# EAGLE schematic lidar (EAGLE 9.3.0)
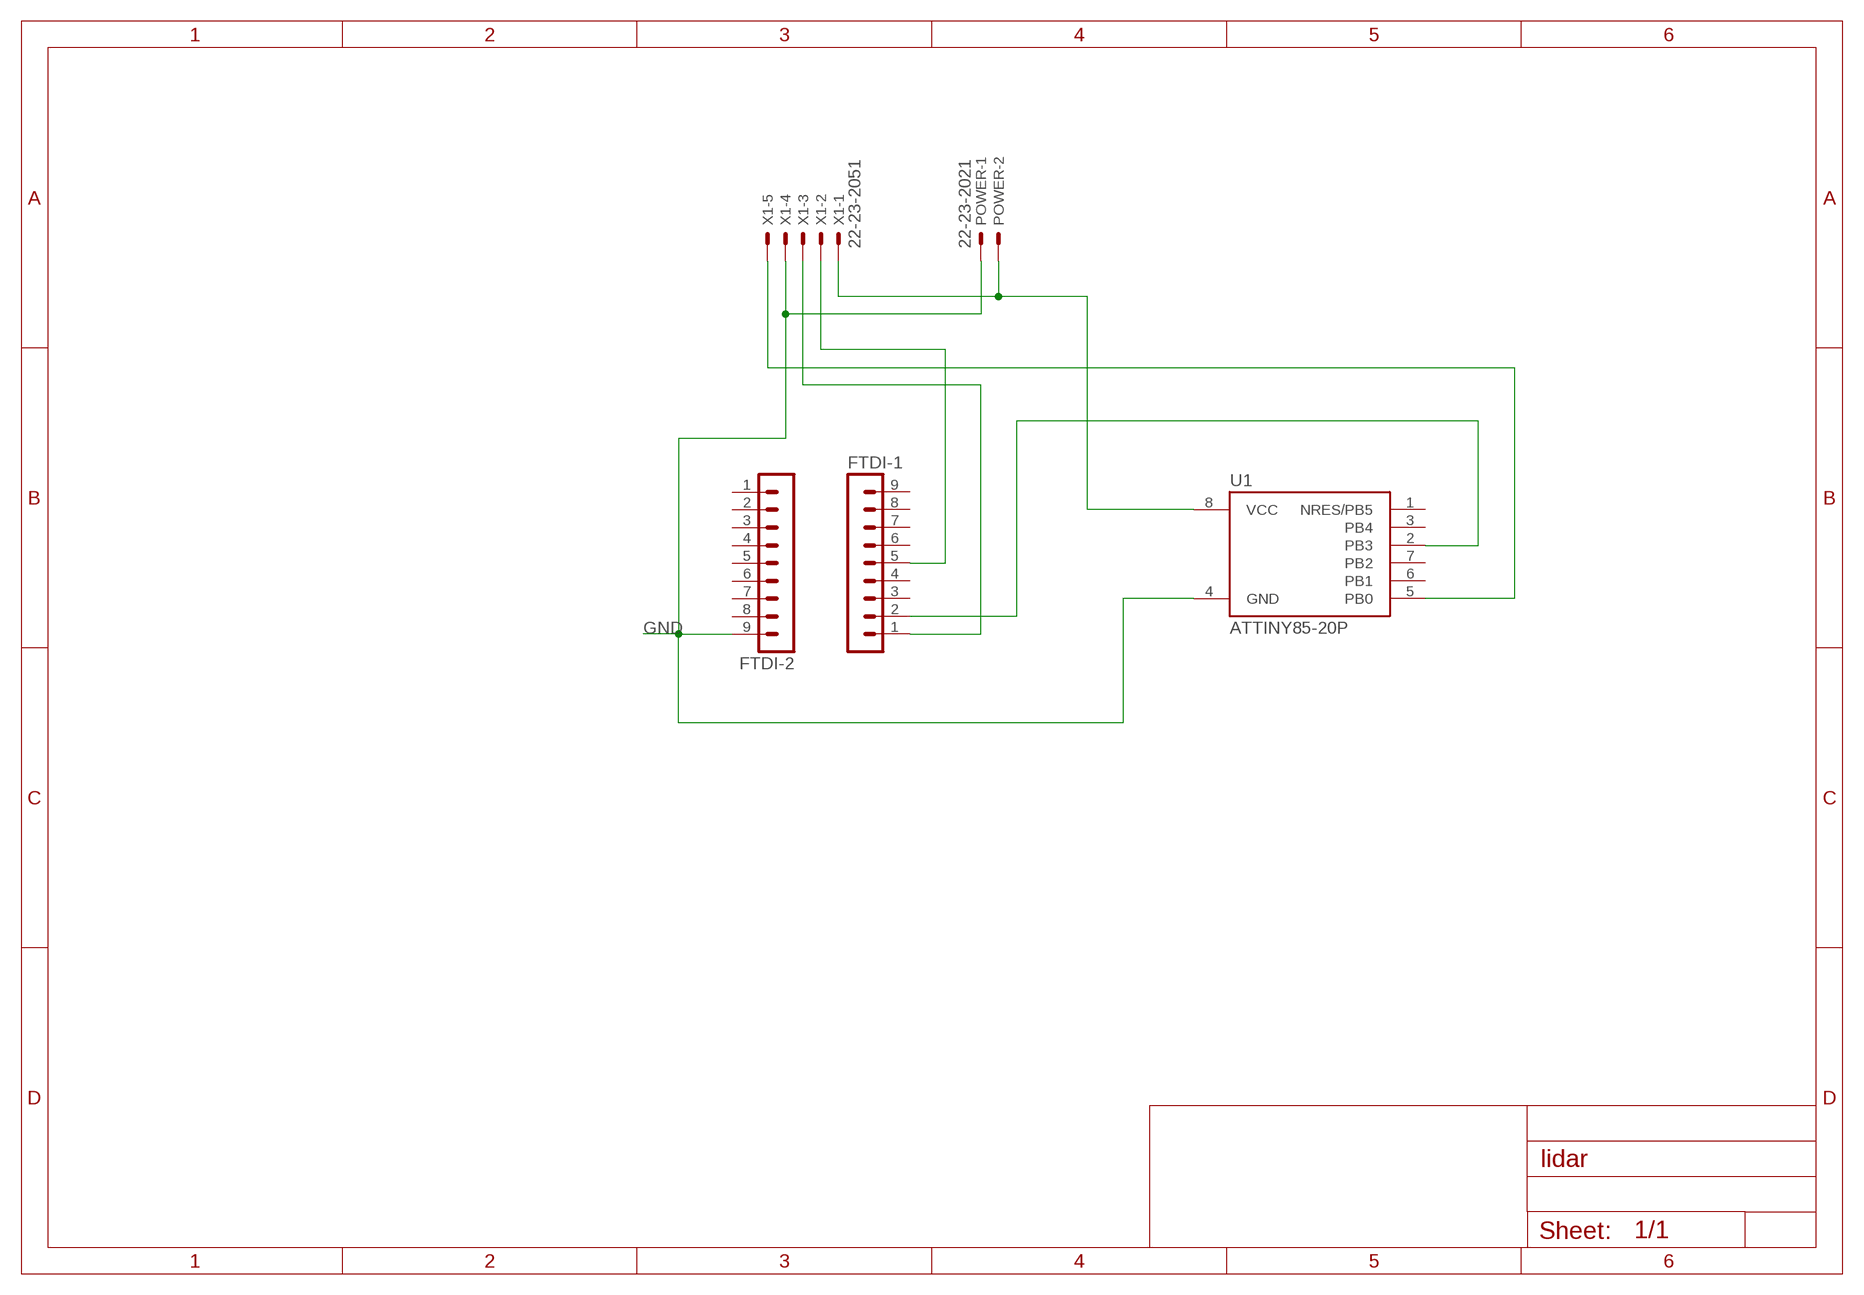
[diagram p0: schematic, sheet 1]

## Parts
FTDI-1  MA09-1  [MA09-1]
FTDI-2  MA09-1  [MA09-1]
POWER  22-23-2021  [22-23-2021]
U1  ATTINY85-20P  [PDIP08_300MIL]
X1  22-23-2051  [22-23-2051]

## Nets
GND: FTDI-2.9 POWER.1 U1.4(GND) X1.4
N$2: FTDI-1.2 U1.2(PB3)
N$3: POWER.2 U1.8(VCC) X1.1
N$4: FTDI-1.5 X1.2
N$5: FTDI-1.1 X1.3
N$7: U1.5(PB0) X1.5
Unconnected: FTDI-1.3 FTDI-1.4 FTDI-1.6 FTDI-1.7 FTDI-1.8 FTDI-1.9 FTDI-2.1 FTDI-2.2 FTDI-2.3 FTDI-2.4 FTDI-2.5 FTDI-2.6 FTDI-2.7 FTDI-2.8 U1.1(NRES/PB5) U1.3(PB4) U1.6(PB1) U1.7(PB2)

## Library data of the parts
FTDI-1 FTDI-2 = con-lstb:MA09-1: PIN HEADER; OC_FARNELL: unknown; OC_NEWARK: unknown
POWER = con-molex:22-23-2021: .100" (2.54mm) Center Header - 2 Pin; MF: MOLEX; MPN: 22-23-2021; OC_FARNELL: 1462926; OC_NEWARK: 25C3832
U1 = _hhn_attiny25_45_85:ATTINY85*: ATMEL ATtiny 85 Packages: P = PDIP 08 30mil S = SOIC 08 EIAJ 208mil Technologies Note: for complete ordering code (temp. range, finish, tape&reel etc.) see www.atmel.com • Supply Voltage: V = (1.8…5.5)V | [blank] = (2.7…5.5)V • Speed: 10 = 10 MHz | 20 = 20 MHz Author: Dipl.-Ing. FH Rainer Bayer HHN Hochschule Heilbronn (Heilbronn University), rainer.bayer@hs-heilbronn.de Ingenieurbüro ing-rb, mail@ing-rb.de
X1 = con-molex:22-23-2051: .100" (2.54mm) Center Header - 5 Pin; MF: MOLEX; MPN: 22-23-2051; OC_FARNELL: 1462952; OC_NEWARK: 38C9178